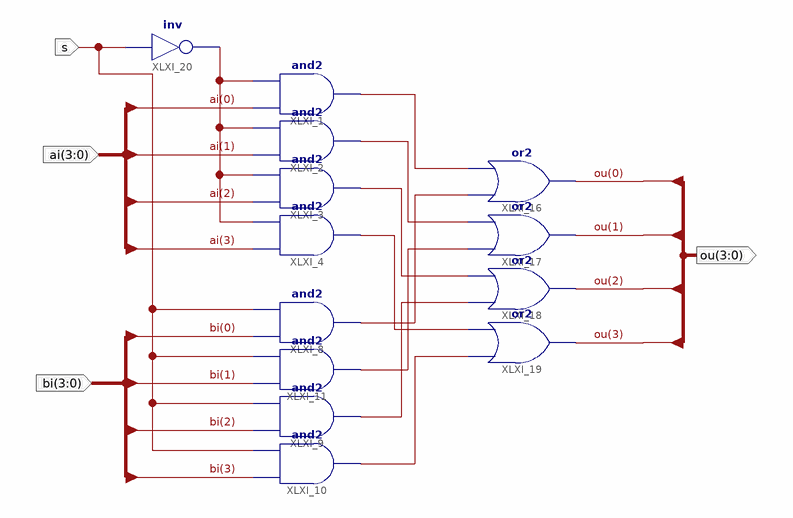
[diagram p0: schematic sheet 1]
// Xilinx ISE schematic MUX_4.sch (kintex7) as structural Verilog: 13 symbols, 4 ports
module MUX_4 (
  input  [3:0] ai,
  input  [3:0] bi,
  input  s,
  output [3:0] ou
);

  wire XLXN_16, XLXN_17, XLXN_18, XLXN_19, XLXN_20, XLXN_21, XLXN_22, XLXN_23, XLXN_25;

  and XLXI_1 (XLXN_16, ai[0], XLXN_25);
  and XLXI_3 (XLXN_18, ai[2], XLXN_25);
  and XLXI_4 (XLXN_19, ai[3], XLXN_25);
  and XLXI_2 (XLXN_17, ai[1], XLXN_25);
  and XLXI_8 (XLXN_20, bi[0], s);
  and XLXI_9 (XLXN_22, bi[2], s);
  and XLXI_10 (XLXN_23, bi[3], s);
  and XLXI_11 (XLXN_21, bi[1], s);
  or XLXI_16 (ou[0], XLXN_20, XLXN_16);
  or XLXI_17 (ou[1], XLXN_21, XLXN_17);
  or XLXI_18 (ou[2], XLXN_22, XLXN_18);
  or XLXI_19 (ou[3], XLXN_23, XLXN_19);
  not XLXI_20 (XLXN_25, s);
endmodule
